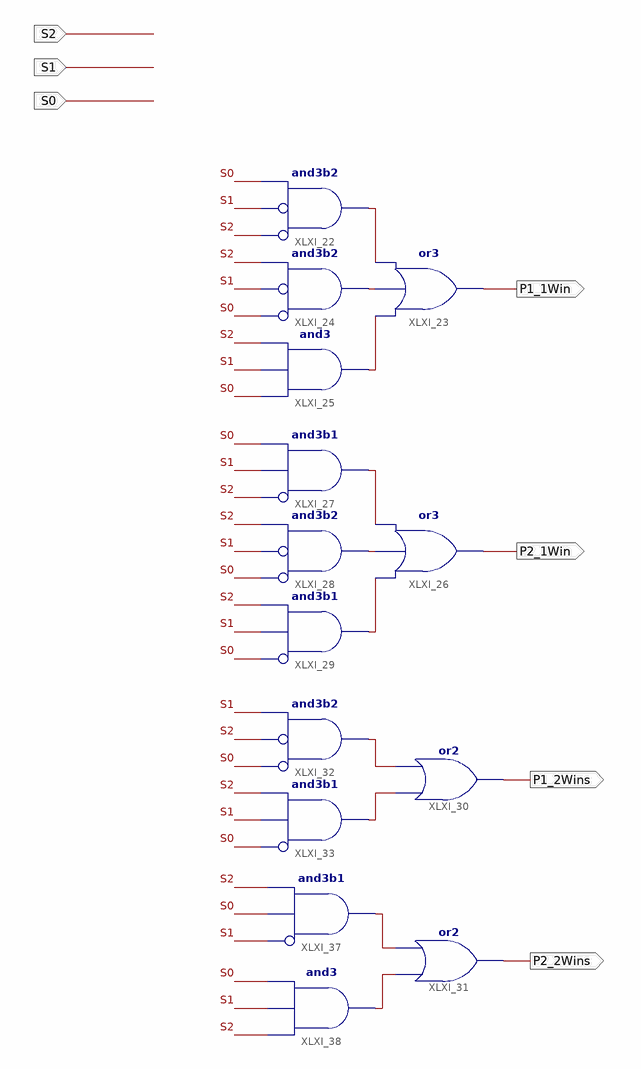
[diagram p0: schematic sheet 1]
// Xilinx ISE schematic StateOutputs.sch (spartan6) as structural Verilog: 14 symbols, 7 ports
module StateOutputs (
  input  S2,
  input  S1,
  input  S0,
  output P1_1Win,
  output P1_2Wins,
  output P2_2Wins,
  output P2_1Win
);

  wire XLXN_60, XLXN_108, XLXN_109, XLXN_121, XLXN_122, XLXN_123, XLXN_131, XLXN_132, XLXN_133, XLXN_134;

  or XLXI_23 (P1_1Win, XLXN_109, XLXN_108, XLXN_60);
  and XLXI_24 (XLXN_108, ~S0, ~S1, S2);  // and3b2
  and XLXI_25 (XLXN_109, S0, S1, S2);
  and XLXI_22 (XLXN_60, ~S2, ~S1, S0);  // and3b2
  and XLXI_32 (XLXN_131, ~S0, ~S2, S1);  // and3b2
  and XLXI_33 (XLXN_132, ~S0, S1, S2);  // and3b1
  or XLXI_30 (P1_2Wins, XLXN_132, XLXN_131);
  and XLXI_37 (XLXN_133, ~S1, S0, S2);  // and3b1
  and XLXI_38 (XLXN_134, S2, S1, S0);
  or XLXI_31 (P2_2Wins, XLXN_134, XLXN_133);
  or XLXI_26 (P2_1Win, XLXN_121, XLXN_122, XLXN_123);
  and XLXI_27 (XLXN_123, ~S2, S1, S0);  // and3b1
  and XLXI_28 (XLXN_122, ~S0, ~S1, S2);  // and3b2
  and XLXI_29 (XLXN_121, ~S0, S1, S2);  // and3b1
endmodule
